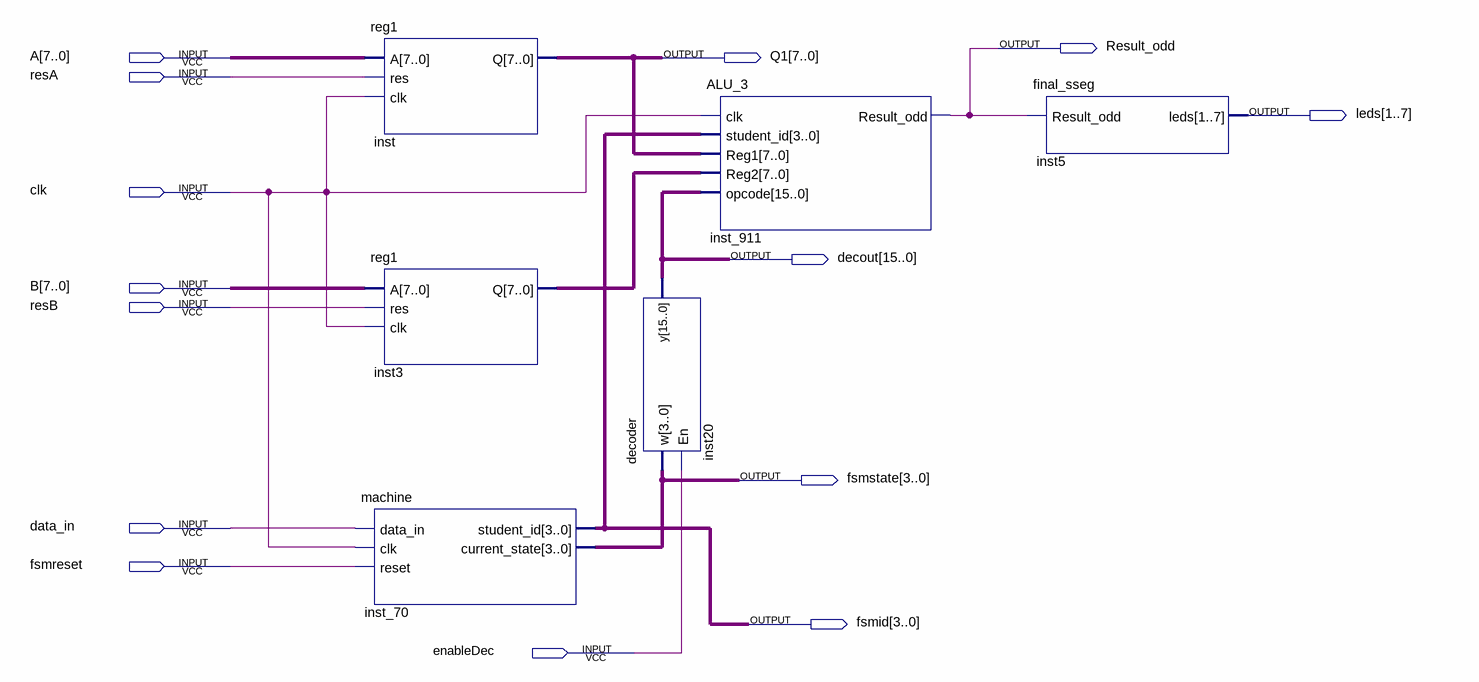
[diagram p0: schematic sheet]
// Quartus schematic lab6_Part3.bdf as structural Verilog: 6 symbols, 14 pins
module lab6_Part3 (
  input  [7:0] A,
  input  resA,
  input  clk,
  input  [7:0] B,
  input  resB,
  input  data_in,
  input  fsmreset,
  input  enableDec,
  output Result_odd,
  output [7:0] Q1,
  output [1:7] leds,
  output [15:0] decout,
  output [3:0] fsmstate,
  output [3:0] fsmid
);

  wire [7:0] inst3_q;

  reg1 inst (.A(A), .res(resA), .clk(clk), .Q(Q1));
  reg1 inst3 (.A(B), .res(resB), .clk(clk), .Q(inst3_q));
  machine inst_70 (.data_in(data_in), .clk(clk), .reset(fsmreset), .student_id(fsmid), .current_state(fsmstate));
  decoder inst20 (.w(fsmstate), .En(enableDec), .y(decout));
  ALU_3 inst_911 (.clk(clk), .student_id(fsmid), .Reg1(Q1), .Reg2(inst3_q), .opcode(decout), .Result_odd(Result_odd));
  final_sseg inst5 (.Result_odd(Result_odd), .leds(leds));
endmodule
